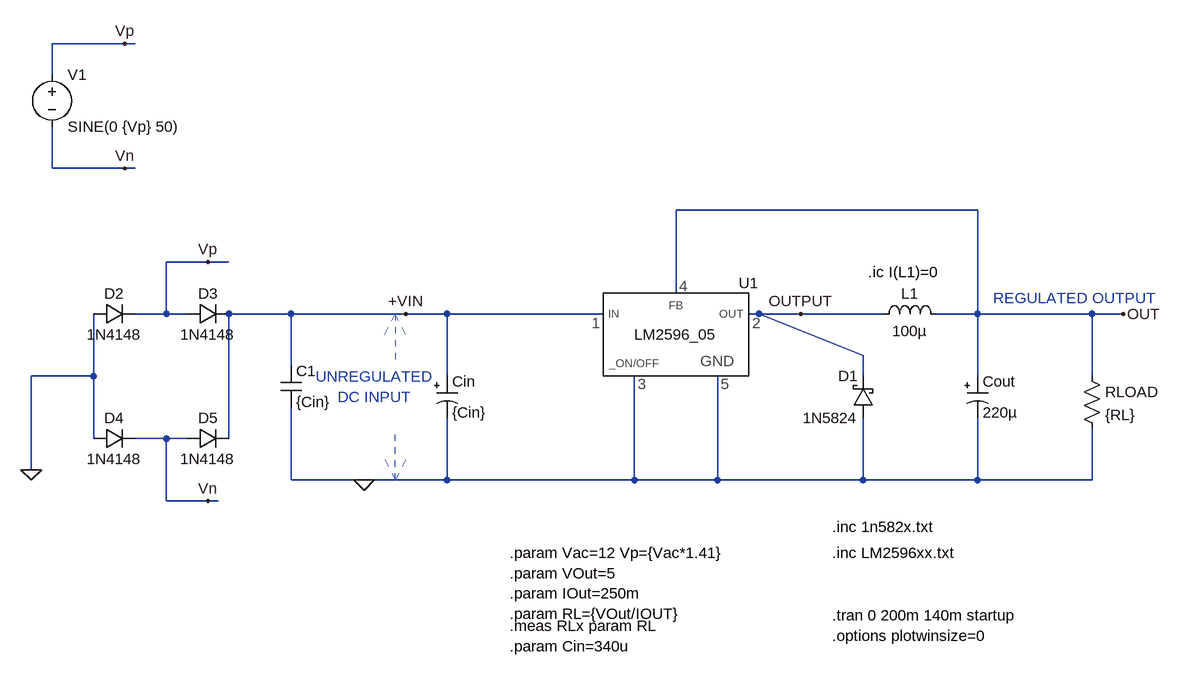
[diagram p0: schematic voltage_input.asc]
voltage_input.asc, the LTspice schematic file:
Version 4
SHEET 1 2324 1244
WIRE -1120 -688 -1232 -688
WIRE -1104 -688 -1120 -688
WIRE -1232 -640 -1232 -688
WIRE -1232 -496 -1232 -560
WIRE -1120 -496 -1232 -496
WIRE -1104 -496 -1120 -496
WIRE 192 -432 -272 -432
WIRE -992 -352 -1056 -352
WIRE -960 -352 -992 -352
WIRE -272 -304 -272 -432
WIRE -1056 -272 -1056 -352
WIRE -1056 -272 -1104 -272
WIRE -1024 -272 -1056 -272
WIRE -864 -272 -960 -272
WIRE -688 -272 -864 -272
WIRE -624 -272 -688 -272
WIRE -384 -272 -624 -272
WIRE -144 -272 -160 -272
WIRE -80 -272 -144 -272
WIRE 48 -272 -80 -272
WIRE 192 -272 192 -432
WIRE 192 -272 128 -272
WIRE 368 -272 192 -272
WIRE 416 -272 368 -272
WIRE 16 -208 -144 -272
WIRE -864 -192 -864 -272
WIRE -1168 -176 -1168 -272
WIRE -1168 -176 -1264 -176
WIRE -624 -176 -624 -272
WIRE 16 -176 16 -208
WIRE 192 -176 192 -272
WIRE 368 -176 368 -272
WIRE -1168 -80 -1168 -176
WIRE -1056 -80 -1104 -80
WIRE -1024 -80 -1056 -80
WIRE -960 -80 -960 -272
WIRE -1264 -32 -1264 -176
WIRE -864 -16 -864 -128
WIRE -752 -16 -864 -16
WIRE -624 -16 -624 -112
WIRE -624 -16 -752 -16
WIRE -336 -16 -336 -176
WIRE -336 -16 -624 -16
WIRE -208 -16 -208 -176
WIRE -208 -16 -336 -16
WIRE 16 -16 16 -112
WIRE 16 -16 -208 -16
WIRE 192 -16 192 -112
WIRE 192 -16 16 -16
WIRE 368 -16 368 -96
WIRE 368 -16 192 -16
WIRE -1056 16 -1056 -80
WIRE -992 16 -1056 16
WIRE -976 16 -992 16
FLAG -80 -272 OUTPUT
FLAG -688 -272 +VIN
FLAG 416 -272 OUT
FLAG -1120 -688 Vp
FLAG -1120 -496 Vn
FLAG -992 -352 Vp
FLAG -992 16 Vn
FLAG -1264 -32 0
FLAG -752 -16 0
SYMBOL ind 32 -256 R270
WINDOW 0 32 56 VTop 2
WINDOW 3 5 56 VBottom 2
SYMATTR InstName L1
SYMATTR Value 100µ
SYMATTR SpiceLine Ipk=3 Rser=50m Cpar=0
SYMBOL res 352 -192 R0
SYMATTR InstName RLOAD
SYMATTR Value {RL}
SYMBOL schottky 32 -112 R180
WINDOW 0 24 64 Left 2
WINDOW 3 24 0 Left 2
SYMATTR InstName D1
SYMATTR Value 1N5824
SYMBOL LM2596xx -272 -240 R0
SYMATTR InstName U1
SYMATTR Value LM2596_05
SYMBOL polcap 176 -176 R0
SYMATTR InstName Cout
SYMATTR Value 220µ
SYMATTR SpiceLine V=16 Irms=460m Rser=0.16 Lser=0 mfg="Nichicon" pn="UPL1C221MPH" type="Al electrolytic"
SYMBOL polcap -640 -176 R0
SYMATTR InstName Cin
SYMATTR Value {Cin}
SYMATTR SpiceLine V=25 Irms=1.27 Rser=0.055 Lser=0
SYMBOL voltage -1232 -656 R0
WINDOW 123 0 0 Left 0
WINDOW 39 0 0 Left 0
SYMATTR InstName V1
SYMATTR Value SINE(0 {Vp} 50)
SYMBOL diode -1168 -64 R270
WINDOW 0 32 32 VTop 2
WINDOW 3 0 32 VBottom 2
SYMATTR InstName D4
SYMATTR Value 1N4148
SYMBOL diode -1168 -256 R270
WINDOW 0 32 32 VTop 2
WINDOW 3 0 32 VBottom 2
SYMATTR InstName D2
SYMATTR Value 1N4148
SYMBOL diode -1024 -256 R270
WINDOW 0 32 32 VTop 2
WINDOW 3 0 32 VBottom 2
SYMATTR InstName D3
SYMATTR Value 1N4148
SYMBOL diode -1024 -64 R270
WINDOW 0 32 32 VTop 2
WINDOW 3 0 32 VBottom 2
SYMATTR InstName D5
SYMATTR Value 1N4148
SYMBOL cap -880 -192 R0
SYMATTR InstName C1
SYMATTR Value {Cin}
TEXT -32 192 Left 2 !.tran 0 200m 140m startup
TEXT 24 -336 Left 2 !.ic I(L1)=0
TEXT -32 96 Left 2 !.inc LM2596xx.txt
TEXT -32 224 Left 2 !.options plotwinsize=0
TEXT -528 96 Left 2 !.param Vac=12 Vp={Vac*1.41}\n.param VOut=5\n.param IOut=250m\n.param RL={VOut/IOUT}
TEXT -528 208 Left 2 !.meas RLx param RL
TEXT -32 56 Left 2 !.inc 1n582x.txt
TEXT -736 -160 Center 2 ;UNREGULATED\nDC INPUT
TEXT 216 -296 Left 2 ;REGULATED OUTPUT
TEXT -528 240 Left 2 !.param Cin=340u
LINE Normal -704 -272 -704 -192 2
LINE Normal -688 -240 -704 -272 2
LINE Normal -720 -240 -704 -272 2
LINE Normal -704 -16 -704 -96 2
LINE Normal -720 -48 -704 -16 2
LINE Normal -688 -48 -704 -16 2

The netlist it stands for:
* voltage_input.asc
L1 OUTPUT OUT 100µ Ipk=3 Rser=50m Cpar=0
RLOAD OUT 0 {RL}
D1 0 OUTPUT 1N5824
XU1 0 OUT +VIN OUTPUT 0 LM2596_05  ; pins _ON/OFF FB IN OUT VGND
Cout OUT 0 220µ V=16 Irms=460m Rser=0.16 Lser=0 mfg="Nichicon" pn="UPL1C221MPH" type="Al electrolytic"
Cin +VIN 0 {Cin} V=25 Irms=1.27 Rser=0.055 Lser=0
V1 Vp Vn SINE(0 {Vp} 50)
D4 0 Vn 1N4148
D2 0 Vp 1N4148
D3 Vp +VIN 1N4148
D5 Vn +VIN 1N4148
C1 +VIN 0 {Cin}
.model D D
.lib standard.dio
.tran 0 200m 140m startup
.ic I(L1)=0
.inc LM2596xx.txt
.options plotwinsize=0
.param Vac=12 Vp={Vac*1.41}
.param VOut=5
.param IOut=250m
.param RL={VOut/IOUT}
.meas RLx param RL
.inc 1n582x.txt
* UNREGULATED
* DC INPUT
* REGULATED OUTPUT
.param Cin=340u
.backanno
.end